# EAGLE design peregigateli+dht (EAGLE 7.5.0)
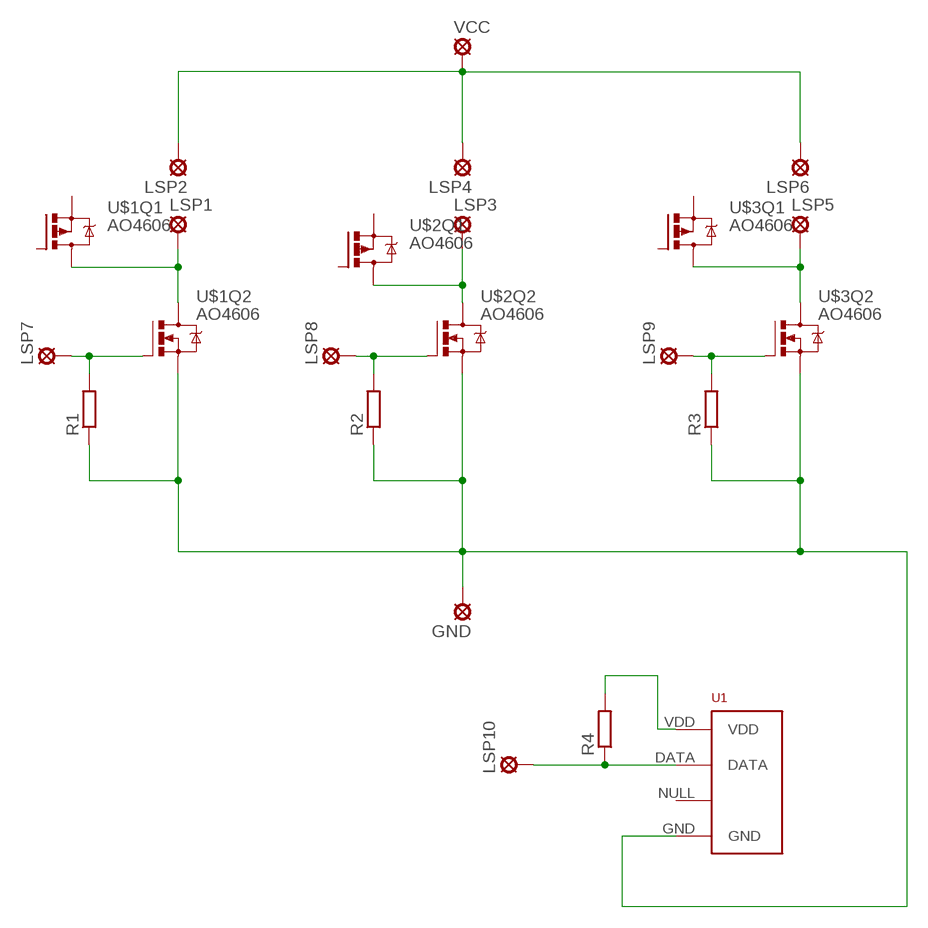
[diagram p0: schematic, sheet 1]

## Parts
GND  LSP10  [LSP10]
LSP1  LSP10  [LSP10]
LSP2  LSP10  [LSP10]
LSP3  LSP10  [LSP10]
LSP4  LSP10  [LSP10]
LSP5  LSP10  [LSP10]
LSP6  LSP10  [LSP10]
LSP7  LSP10  [LSP10]
LSP8  LSP10  [LSP10]
LSP9  LSP10  [LSP10]
LSP10  LSP10  [LSP10]
R1  R-EU_0207/10  [0207/10]
R2  R-EU_0207/10  [0207/10]
R3  R-EU_0207/10  [0207/10]
R4  R-EU_0207/10  [0207/10]
U1  RHT03_DHT-22_AM2302RA  [RHT03_DHT-22/RA]
U$1  AO4606  [SOIC-8]
U$2  AO4606  [SOIC-8]
U$3  AO4606  [SOIC-8]
VCC  LSP10  [LSP10]

## Nets
GND: GND.MP R1.1 R2.1 R3.1 U1.GND U$1.1(Q2:S) U$2.1(Q2:S) U$3.1(Q2:S)
N$1: LSP10.MP R4.1 U1.DATA
N$2: LSP2.MP LSP4.MP LSP6.MP VCC.MP
N$3: LSP1.MP U$1.5(Q1:D) U$1.6(Q1:D) U$1.7(Q2:D) U$1.8(Q2:D)
N$4: LSP3.MP U$2.5(Q1:D) U$2.6(Q1:D) U$2.7(Q2:D) U$2.8(Q2:D)
N$5: R4.2 U1.VDD
N$7: LSP5.MP U$3.5(Q1:D) U$3.6(Q1:D) U$3.7(Q2:D) U$3.8(Q2:D)
N$8: LSP9.MP R3.2 U$3.2(Q2:G)
N$11: LSP7.MP R1.2 U$1.2(Q2:G)
N$12: LSP8.MP R2.2 U$2.2(Q2:G)
Unconnected: U1.NULL U$1.3(Q1:S) U$1.4(Q1:G) U$2.3(Q1:S) U$2.4(Q1:G) U$3.3(Q1:S) U$3.4(Q1:G)

## Library data of the parts
GND LSP1-LSP10 VCC = solpad:LSP10: SOLDER PAD drill 1.0 mm, distributor Buerklin, 12H555
R1-R4 = resistor:R-EU_: RESISTOR, European symbol
U1 = RHT03_DHT-22_AM2302:RHT03_DHT-22_AM2302: RHT03 / DHT-22 / AM2302 Packages and symbol for the RHT03 / DHT-22 relative humidity and temperature sensor. Note: The AM2302 is a wired version of the DHT-22 which typically requires less clearance and is thus provided as a separate package.; PROD_ID: SEN-10167
U$1-U$3 = elements:AO4606: Complementary MOSFET A04606 The AO4606 uses advanced trench technology MOSFETs to provide excellent RDS(ON) and low gate charge. The complementary MOSFETs may be used to form a level shifted high side switch, and for a host of other applications. http://www.aosmd.com/pdfs/datasheet/ao4606.pdf

## Board
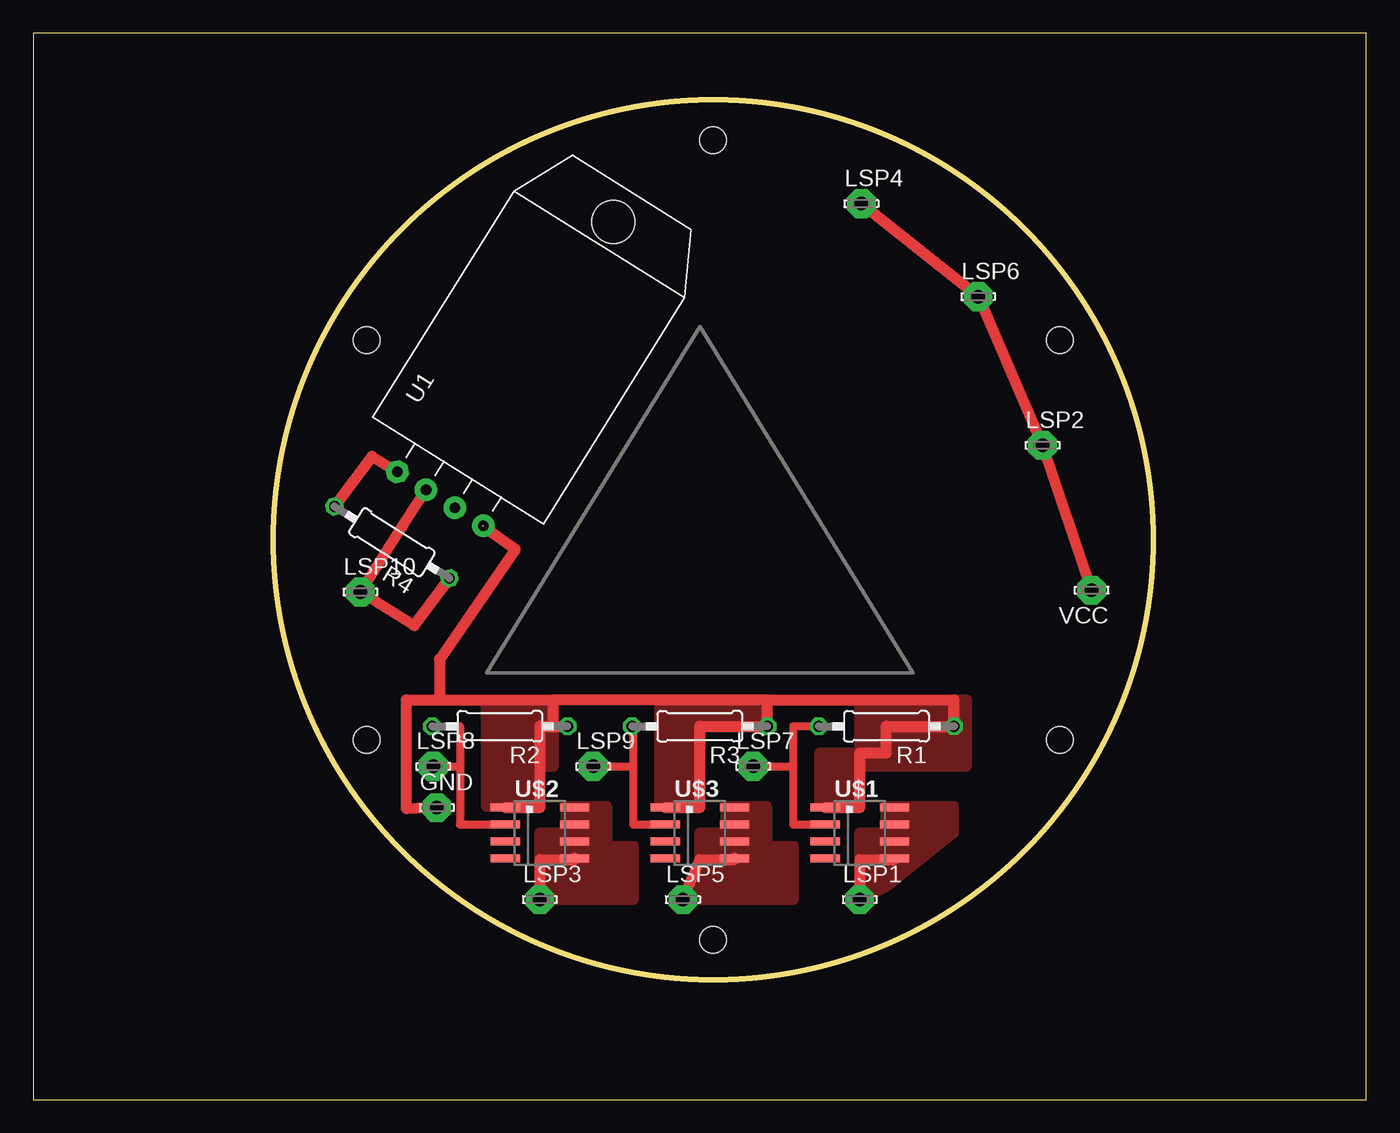
[diagram p1: board, top side]

Size 100 x 80 mm. Coordinates in mm from the lower left corner, seen from the top.
Outline: 0,0 100,0 100,80 0,80 0,0
Outline: circle at 51,42 radius 33
Copper layers (1*16): Top 0.035mm / dielectric 1.5mm / Bottom 0.035mm
Design rules "default": minimum track width 10mil, minimum drill 24mil, track to track 8mil, track to pad 8mil, pad to pad 8mil, via to via 8mil, smd to smd 8mil, copper to edge 40mil, drill to drill 8mil, minimum pad ring 10mil, minimum via ring 8mil, stop-mask expansion 4mil, vias tented up to drill 0mil, thermal gap 10mil
Holes 2 mm at 77,27 51,72 77,57 25,27 25,57 51,12

### Footprints (pad centres in the part's own frame; a part is rotated, then mirrored left to right if it is on the bottom)
LSP10 = drill 1.016 pad 2.159 octagon: MP 0,0
0207/10 = drill 0.813 octagon: 1 -5.08,0; 2 5.08,0
RHT03_DHT-22/RA = drill 0.8 pad 1.676: DATA -1.27,0; GND 3.81,0; NULL 1.27,0 | drill 0.8 pad 1.676 octagon: VDD -3.81,0 | hole 3.25: 0,24.5
SOIC-8 = smd 0.6 x 2.2: 1 -1.905,-2.6; 2 -0.635,-2.6; 3 0.635,-2.6; 4 1.905,-2.6; 5 1.905,2.6; 6 0.635,2.6; 7 -0.635,2.6; 8 -1.905,2.6

### Placement (x,y rotation side)
GND  30.27,21.91 0 top
LSP1  62,15 0 top
LSP2  75.72,49.08 0 top
LSP3  38,15 0 top
LSP4  62.12,67.22 0 top
LSP5  48.73,15 0 top
LSP6  70.89,60.24 0 top
LSP7  54,25 0 top
LSP8  30,25 0 top
LSP9  42,25 0 top
LSP10  24.54,38.08 0 top
R1  64,28 180 top
R2  35,28 180 top
R3  50,28 180 top
R4  26.91,41.81 148 top
U1  30.54,45.08 328 top
U$1  62,20 270 top
U$2  38,20 270 top
U$3  50,20 270 top
VCC  79.39,38.22 180 top

### Tracks (layer width: path | path; a pad name or v marks a point on that pad's centre or on a via)
GND  (1 unrouted)
  Top 0.813: U$2.1 38,21.91 38,28 R2.1 39,28 39,30 | U$3.1 50,21.91 50,28 R3.1 55.08,30 | U$1.1 62,21.91 62,26 64,26 64,28 R1.1 69.08,30 55.08,30 | 55.08,30 39,30 | 30.48,30 28,30 28,21.82 GND.MP | 30.48,30 39,30 | 30.48,30 30.48,33.02 36.17,41.29 33.66,43.06
  pour Top (no thermals): 34,22 34,30 39,30 39,25 38,25 38,22
  pour Top (no thermals): 47,22 47,30 55,30 55,28 50,28 50,22
  pour Top (no thermals): 59,22 59,26 62,26 62,30 70,30 70,25 62,25 62,22
N$1
  Top 0.813: U1.DATA 27.69,42.98 LSP10.MP 28.57,35.56 R4.1
N$2
  Top 0.813: LSP4.MP LSP6.MP LSP2.MP VCC.MP
N$3
  Top 0.813: LSP1.MP 62,18 64.6,18
  pour Top (no thermals): 64,22 69,22 69,20 64,16 62,15 62,20 64,20
N$4
  Top 0.813: LSP3.MP 38,18 40.6,18 U$2.5
  pour Top (no thermals): 40,22 43,22 43,19 45,19 45,15 38,15 38,20 40,20
N$5
  Top 0.813: R4.2 25.4,48.26 U1.VDD
N$7
  Top 0.813: LSP5.MP 50,18 52.6,18 U$3.5
  pour Top (no thermals): 52,22 55,22 55,19 57,19 57,15 50,15 50,20 52,20
N$8
  Top 0.406: R3.2 45,27.92
  Top 0.61: 45,27.92 45,25 | 45,25 45,20.64 U$3.2 | LSP9.MP 45,25
N$11
  Top 0.61: R1.2 57,28 57,25 | 57,25 57,20.64 U$1.2 | LSP7.MP 57,25
N$12
  Top 0.406: R2.2 32,28
  Top 0.61: 32,28 32,25 | 32,25 32,20.64 U$2.2 | LSP8.MP 32,25